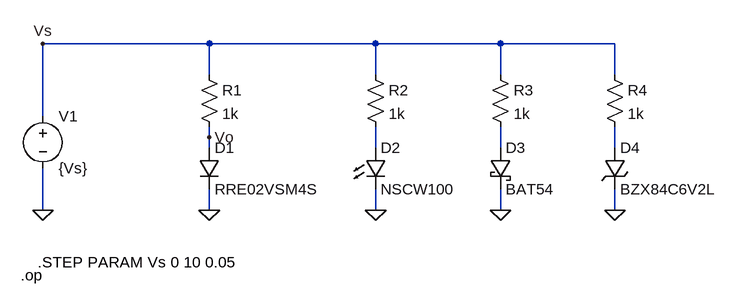
[diagram p0: schematic Circuit_04.asc]
Circuit_04.asc, the LTspice schematic file:
Version 4
SHEET 1 1008 680
WIRE 224 48 -32 48
WIRE 480 48 224 48
WIRE 672 48 480 48
WIRE 848 48 672 48
WIRE 224 96 224 48
WIRE 480 96 480 48
WIRE 672 96 672 48
WIRE 848 96 848 48
WIRE -32 160 -32 48
WIRE 224 192 224 176
WIRE 224 208 224 192
WIRE 480 208 480 176
WIRE 672 208 672 176
WIRE 848 208 848 176
WIRE -32 304 -32 240
WIRE 224 304 224 272
WIRE 480 304 480 272
WIRE 672 304 672 272
WIRE 848 304 848 272
FLAG 224 304 0
FLAG -32 304 0
FLAG -32 48 Vs
FLAG 224 192 Vo
FLAG 480 304 0
FLAG 672 304 0
FLAG 848 304 0
SYMBOL res 208 80 R0
SYMATTR InstName R1
SYMATTR Value 1k
SYMBOL voltage -32 144 R0
WINDOW 123 0 0 Left 0
WINDOW 39 0 0 Left 0
SYMATTR InstName V1
SYMATTR Value {Vs}
SYMBOL diode 208 208 R0
SYMATTR InstName D1
SYMATTR Value RRE02VSM4S
SYMBOL res 464 80 R0
SYMATTR InstName R2
SYMATTR Value 1k
SYMBOL LED 464 208 R0
SYMATTR InstName D2
SYMATTR Value NSCW100
SYMATTR Description Diode
SYMATTR Type diode
SYMBOL res 656 80 R0
SYMATTR InstName R3
SYMATTR Value 1k
SYMBOL schottky 656 208 R0
SYMATTR InstName D3
SYMATTR Value BAT54
SYMATTR Description Diode
SYMATTR Type diode
SYMBOL res 832 80 R0
SYMATTR InstName R4
SYMATTR Value 1k
SYMBOL zener 832 208 R0
SYMATTR InstName D4
SYMATTR Value BZX84C6V2L
SYMATTR Description Diode
SYMATTR Type diode
TEXT -40 384 Left 2 !.STEP PARAM Vs 0 10 0.05
TEXT -66 404 Left 2 !.op

The netlist it stands for:
* Circuit_04.asc
R1 Vs Vo 1k
V1 Vs 0 {Vs}
D1 Vo 0 RRE02VSM4S
R2 Vs N001 1k
D2 N001 0 NSCW100
R3 Vs N002 1k
D3 N002 0 BAT54
R4 Vs N003 1k
D4 N003 0 BZX84C6V2L
.model D D
.lib standard.dio
.STEP PARAM Vs 0 10 0.05
.op
.backanno
.end